# Altium schematic sheet APM9328_PERIPH.SchDoc: UART & USB
size A4; Author: NC; Revision: 1.0; SheetNumber: 5; SheetTotal: 14
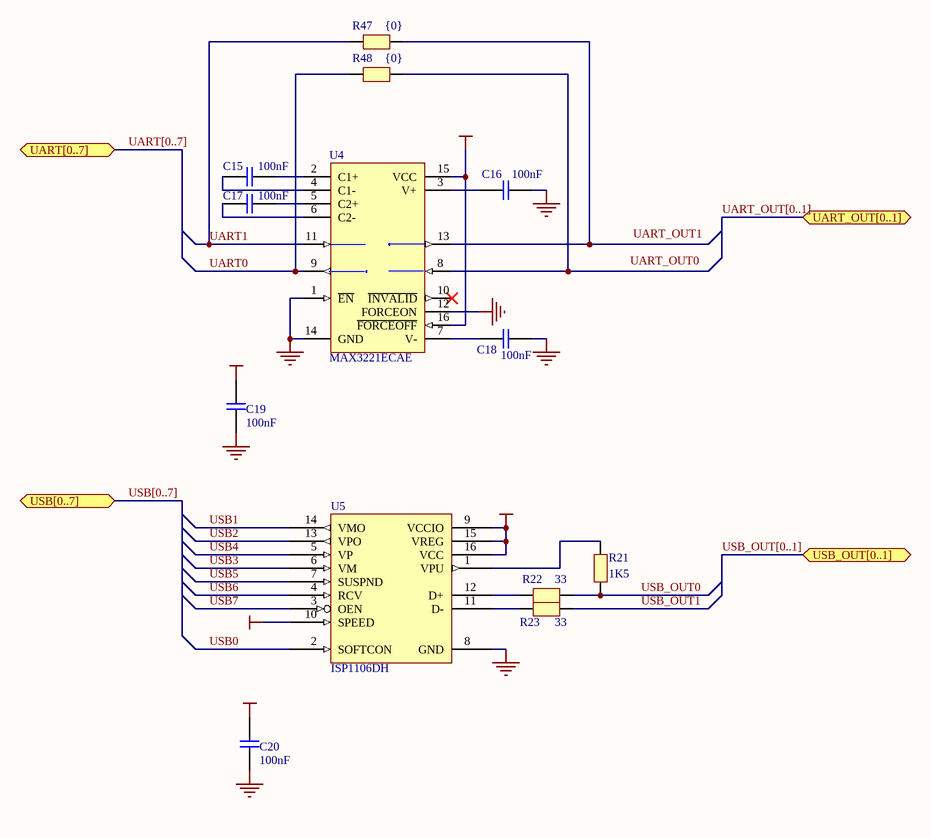
[diagram p0: APM9328_PERIPH.SchDoc]

## Parts
C15  100nF  [0402]
C16  100nF  [0402]
C17  100nF  [0402]
C18  100nF  [0402]
C19  100nF  [0402]
C20  100nF  [0402]
R21  1K5  [0402]
R22  33  [0402]
R23  33  [0402]
R47  {0}  [0402]
R48  {0}  [0402]
U4  MAX3221ECAE  [TSSOP16]
U5  ISP1106DH  [TSSOP16]

## Ports
UART[0..7] (bidir), UART_OUT[0..1] (bidir), USB[0..7] (bidir), USB_OUT[0..1] (bidir)

## Nets
+3V3: C19.1 C20.1 U4.15(VCC) U4.16(~{FORCEOFF}) U5.9(VCCIO) U5.10(SPEED) U5.15(VREG) U5.16(VCC)
GND: C16.2 C18.2 C19.2 C20.2 U4.1(~{EN}) U4.12(FORCEON) U4.14(GND) U5.8(GND)
UART0: R48.1 U4.9(R1OUT)
UART1: R47.1 U4.11(T1IN)
USB0: U5.2(SOFTCON)
USB1: U5.14(VMO)
USB2: U5.13(VPO)
USB3: U5.6(VM)
USB4: U5.5(VP)
USB5: U5.7(SUSPND)
USB6: U5.4(RCV)
USB7: U5.3(OEN)
USB_OUT0: R21.1 R22.2
USB_OUT1: R23.2
NetC15_1: C15.1 U4.4(C1-)
NetC15_2: C15.2 U4.2(C1+)
NetC16_1: C16.1 U4.3(V+)
NetC17_1: C17.1 U4.6(C2-)
NetC17_2: C17.2 U4.5(C2+)
NetC18_1: C18.1 U4.7(V-)
NetR21_2: R21.2 U5.1(VPU)
NetR22_1: R22.1 U5.12(D+)
NetR23_1: R23.1 U5.11(D-)
NetR47_2: R47.2 U4.13(T1OUT)
NetR48_2: R48.2 U4.8(R1IN)

Not connected (* = marked no-connect by the designer): U4 10(~{INVALID})*

## Buses and harness runs
bus UART[0..7] = port UART[0..7]
bus UART_OUT[0..1] = port UART_OUT[0..1]
bus USB[0..7] = port USB[0..7]
bus USB_OUT[0..1] = port USB_OUT[0..1]

## Notes on the sheet
- Labels drawn without touching a wire or pin: UART_OUT0, UART_OUT1
- Title
- Size:
- Date:
- A4
- Author:
- Revision:
- Sheet
- of
- Armadeus Embedded Solutions
- File:

## Library data of the parts
C15-C20 = Cap
R21-R23 R47 R48 = Res
U4 = MAX3221ECAE: ±15kV ESD-Protected, 1µA, 3.0V/5.5V, 250kbps, RS-232 Transceiver with AutoShutdown; Manufacturer: Texas Instrument; Part Number: MAX3221CPWR; PackageDocument: 1996; Published: 16-Jan-2001; LatestRevisionDate: 17-Jul-2002; LatestRevisionNote: Re-released for DXP Platform.; DatasheetDocument: Jan-1998; PackageReference: SSOP16; Publisher: Altium Limited; Distributor: Digikey; Price_100: 0,75; Price_500: 0,675; Price_1000: 0,65
U5 = ISP1106: USB 1.1 transceiver; Manufacturer: Philips; Part Number: ISP1106DH; Distributor: Avnet; Price_100: 0,594; Price_500: 0,48; Price_1000: 0,47